# Altium schematic sheet SkayboardRev4.SchDoc
size A0
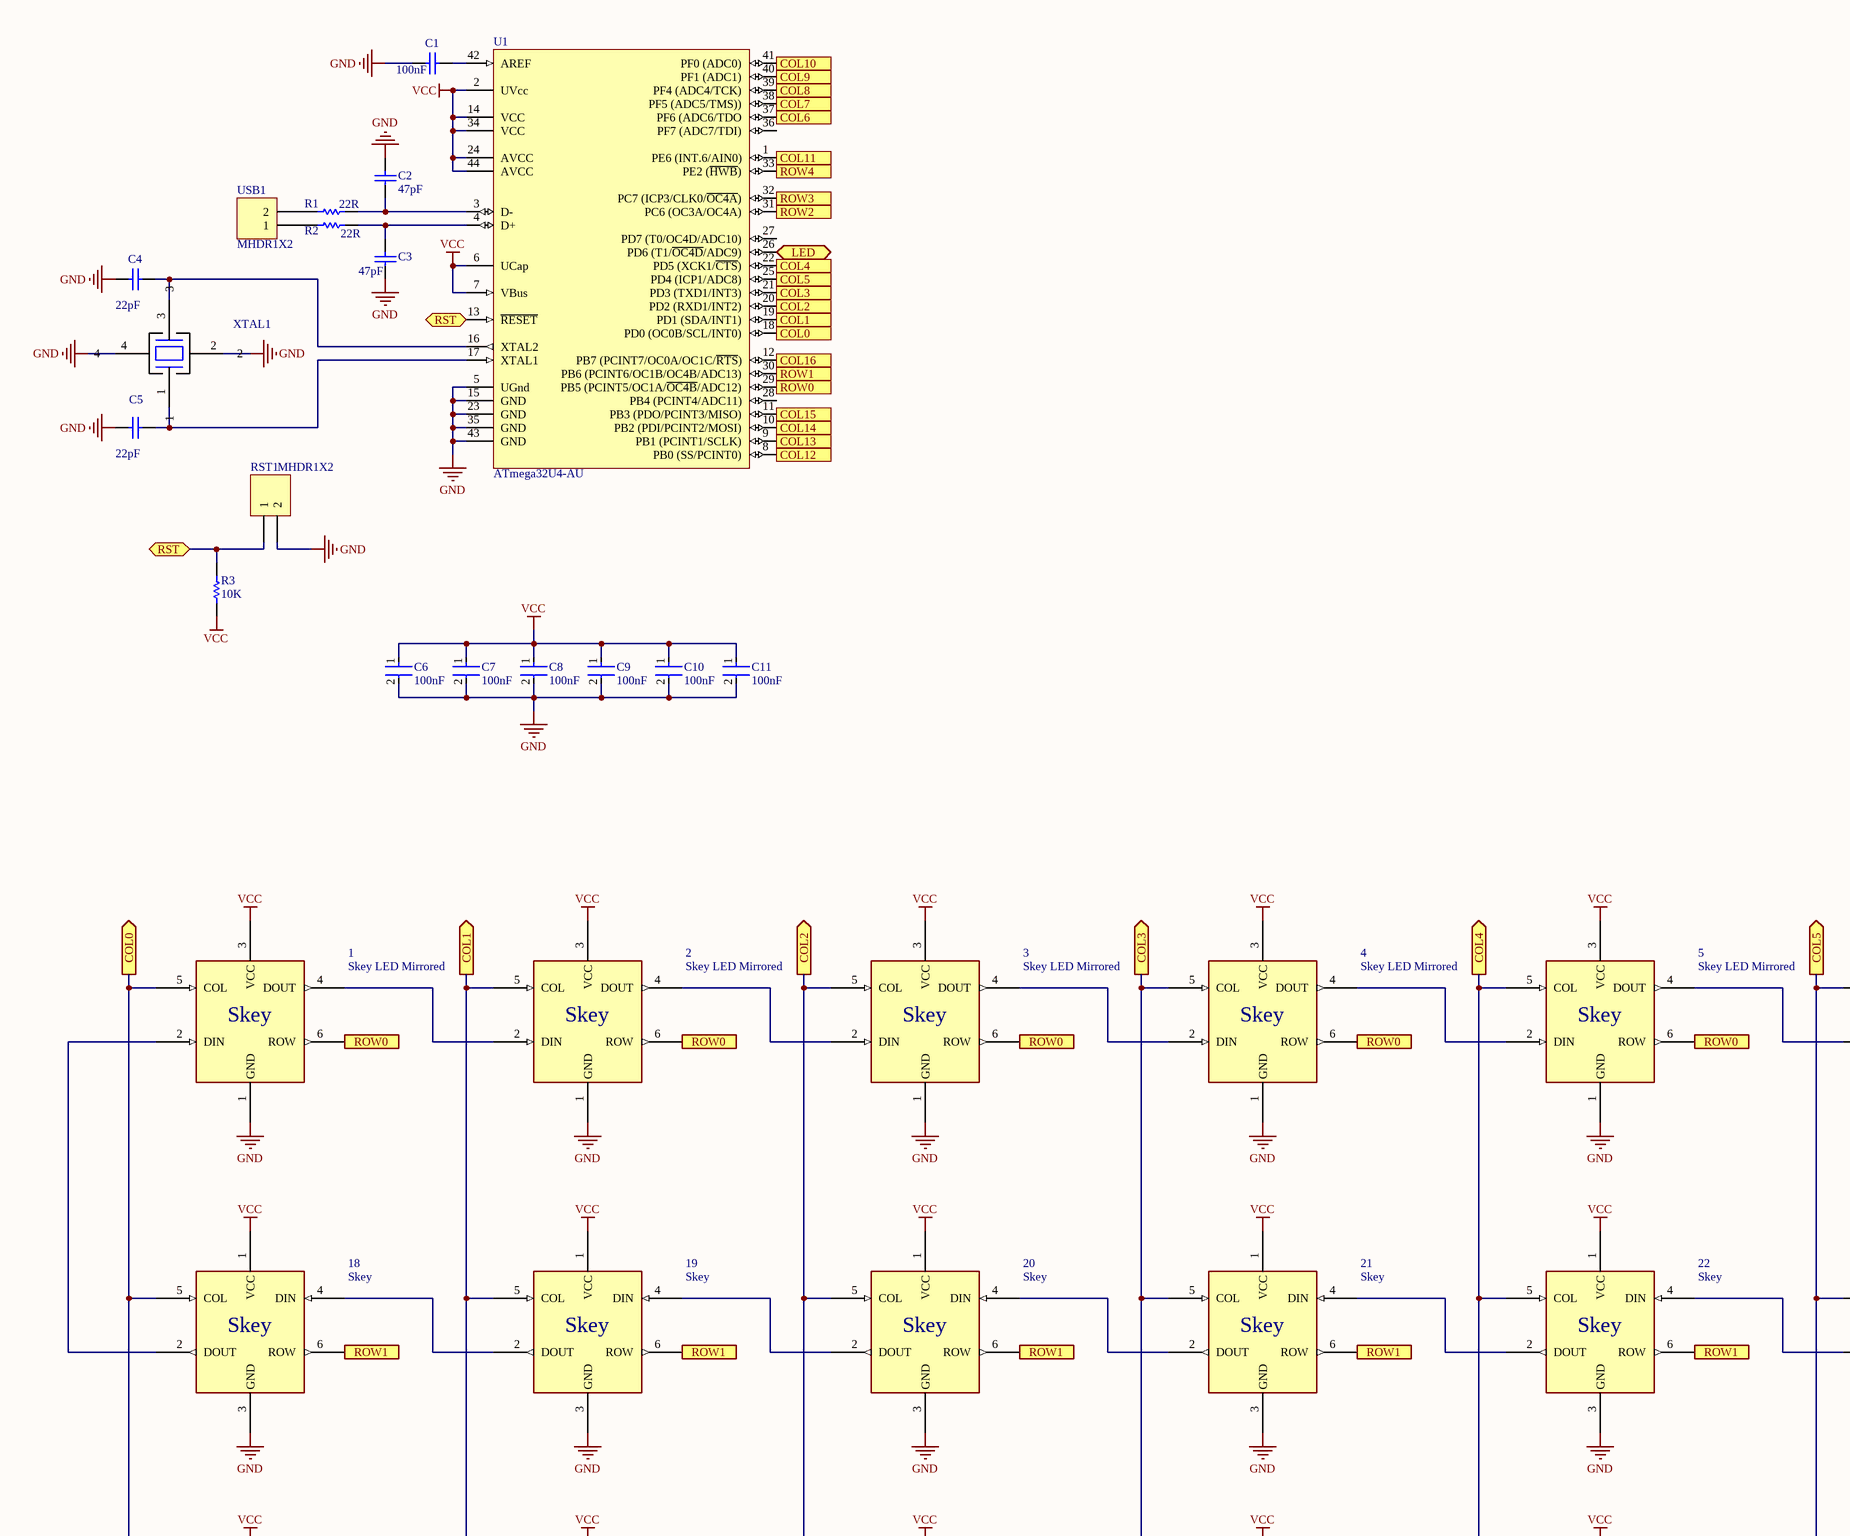
[diagram p0: SkayboardRev4.SchDoc, top left]
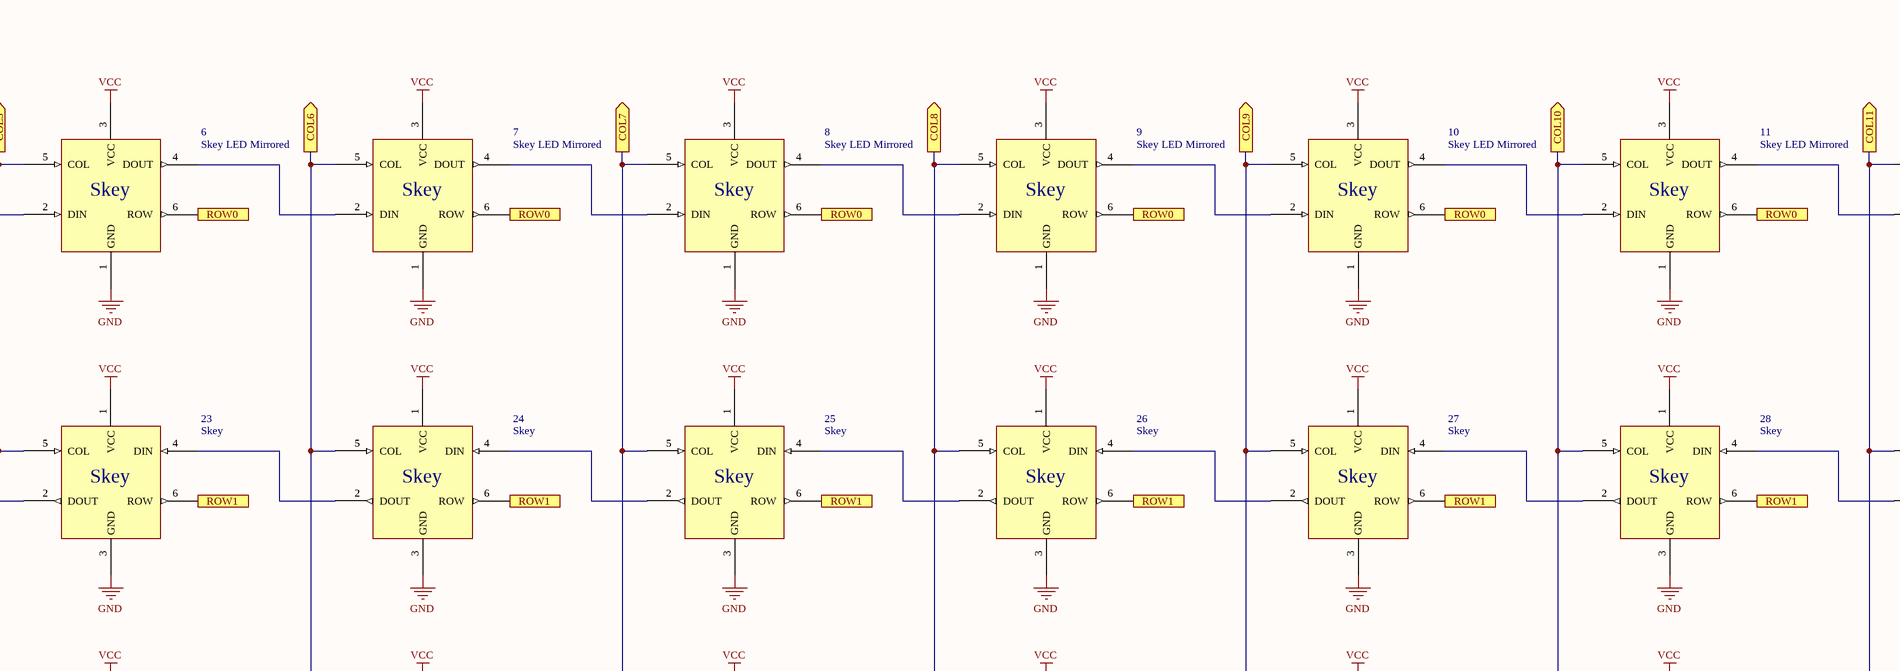
[diagram p1: SkayboardRev4.SchDoc, top middle]
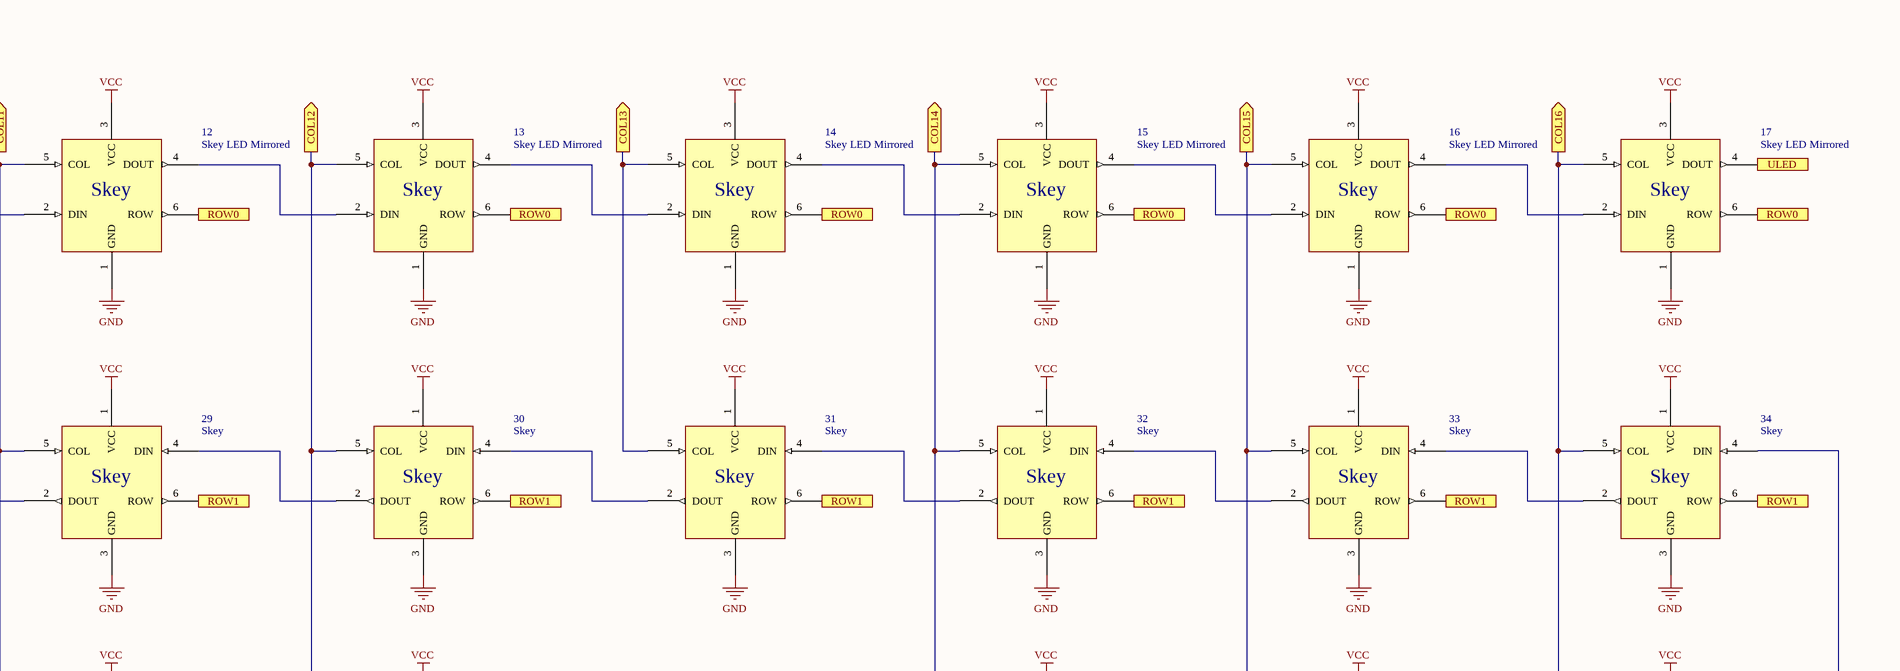
[diagram p2: SkayboardRev4.SchDoc, top right]
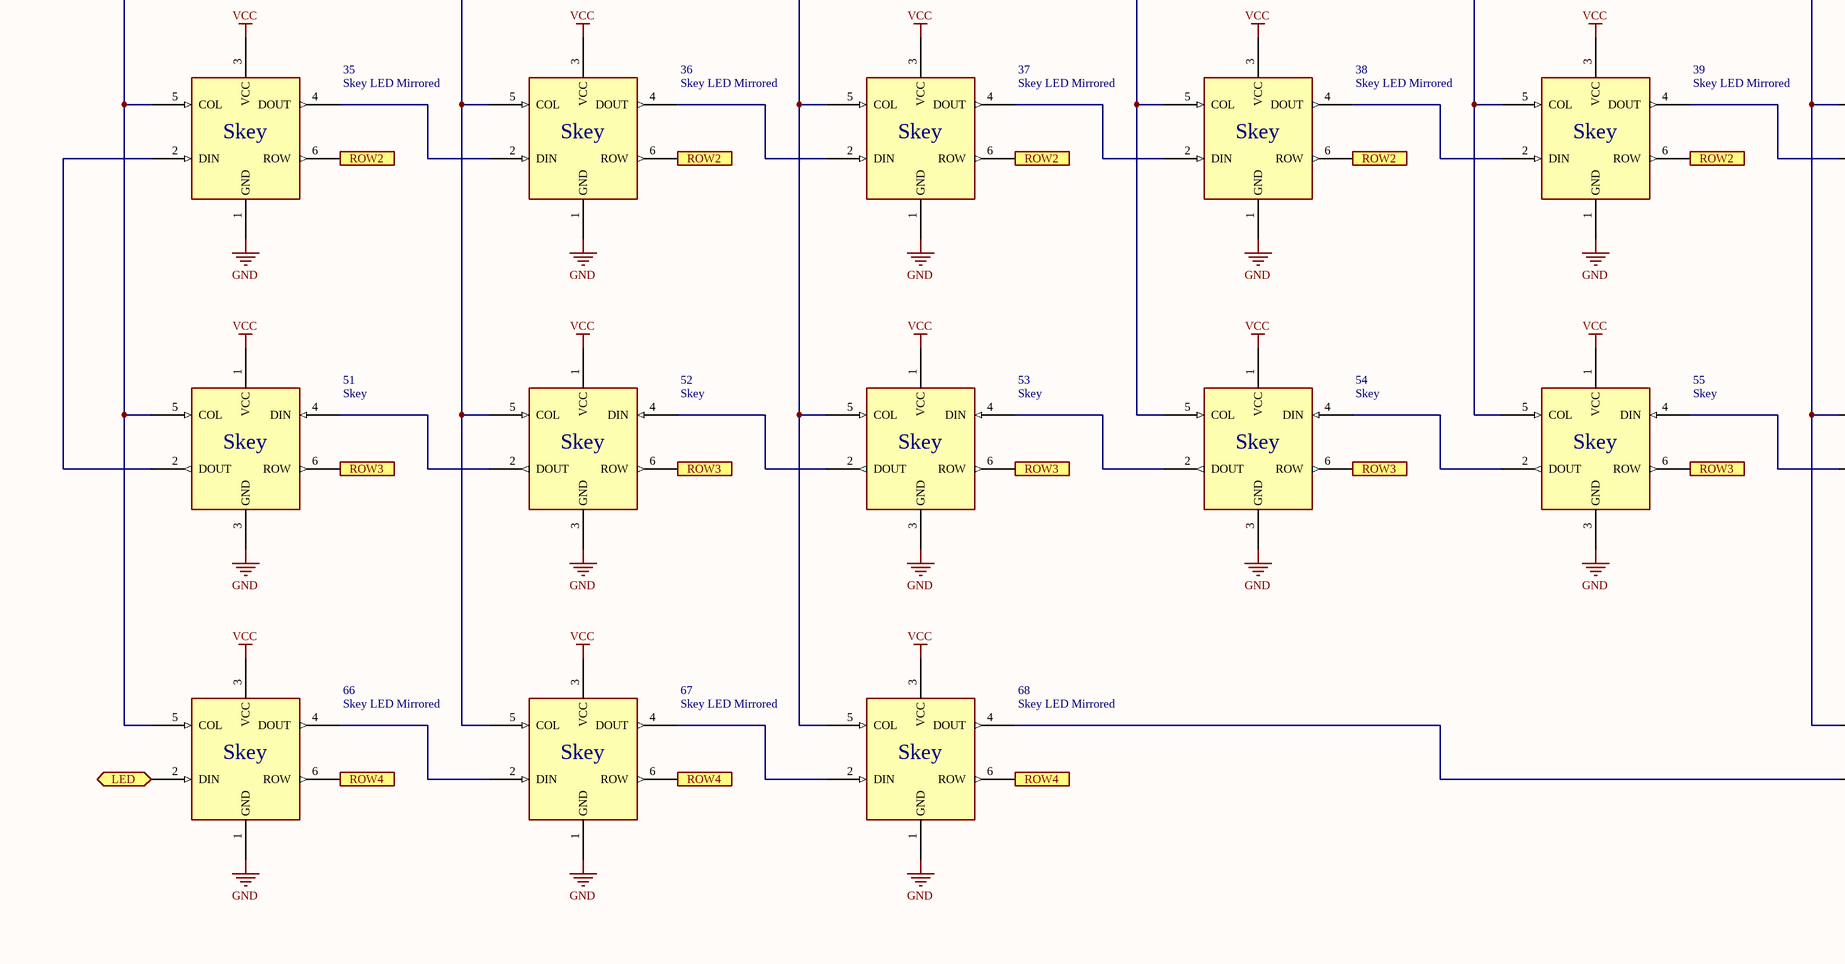
[diagram p3: SkayboardRev4.SchDoc, bottom left]
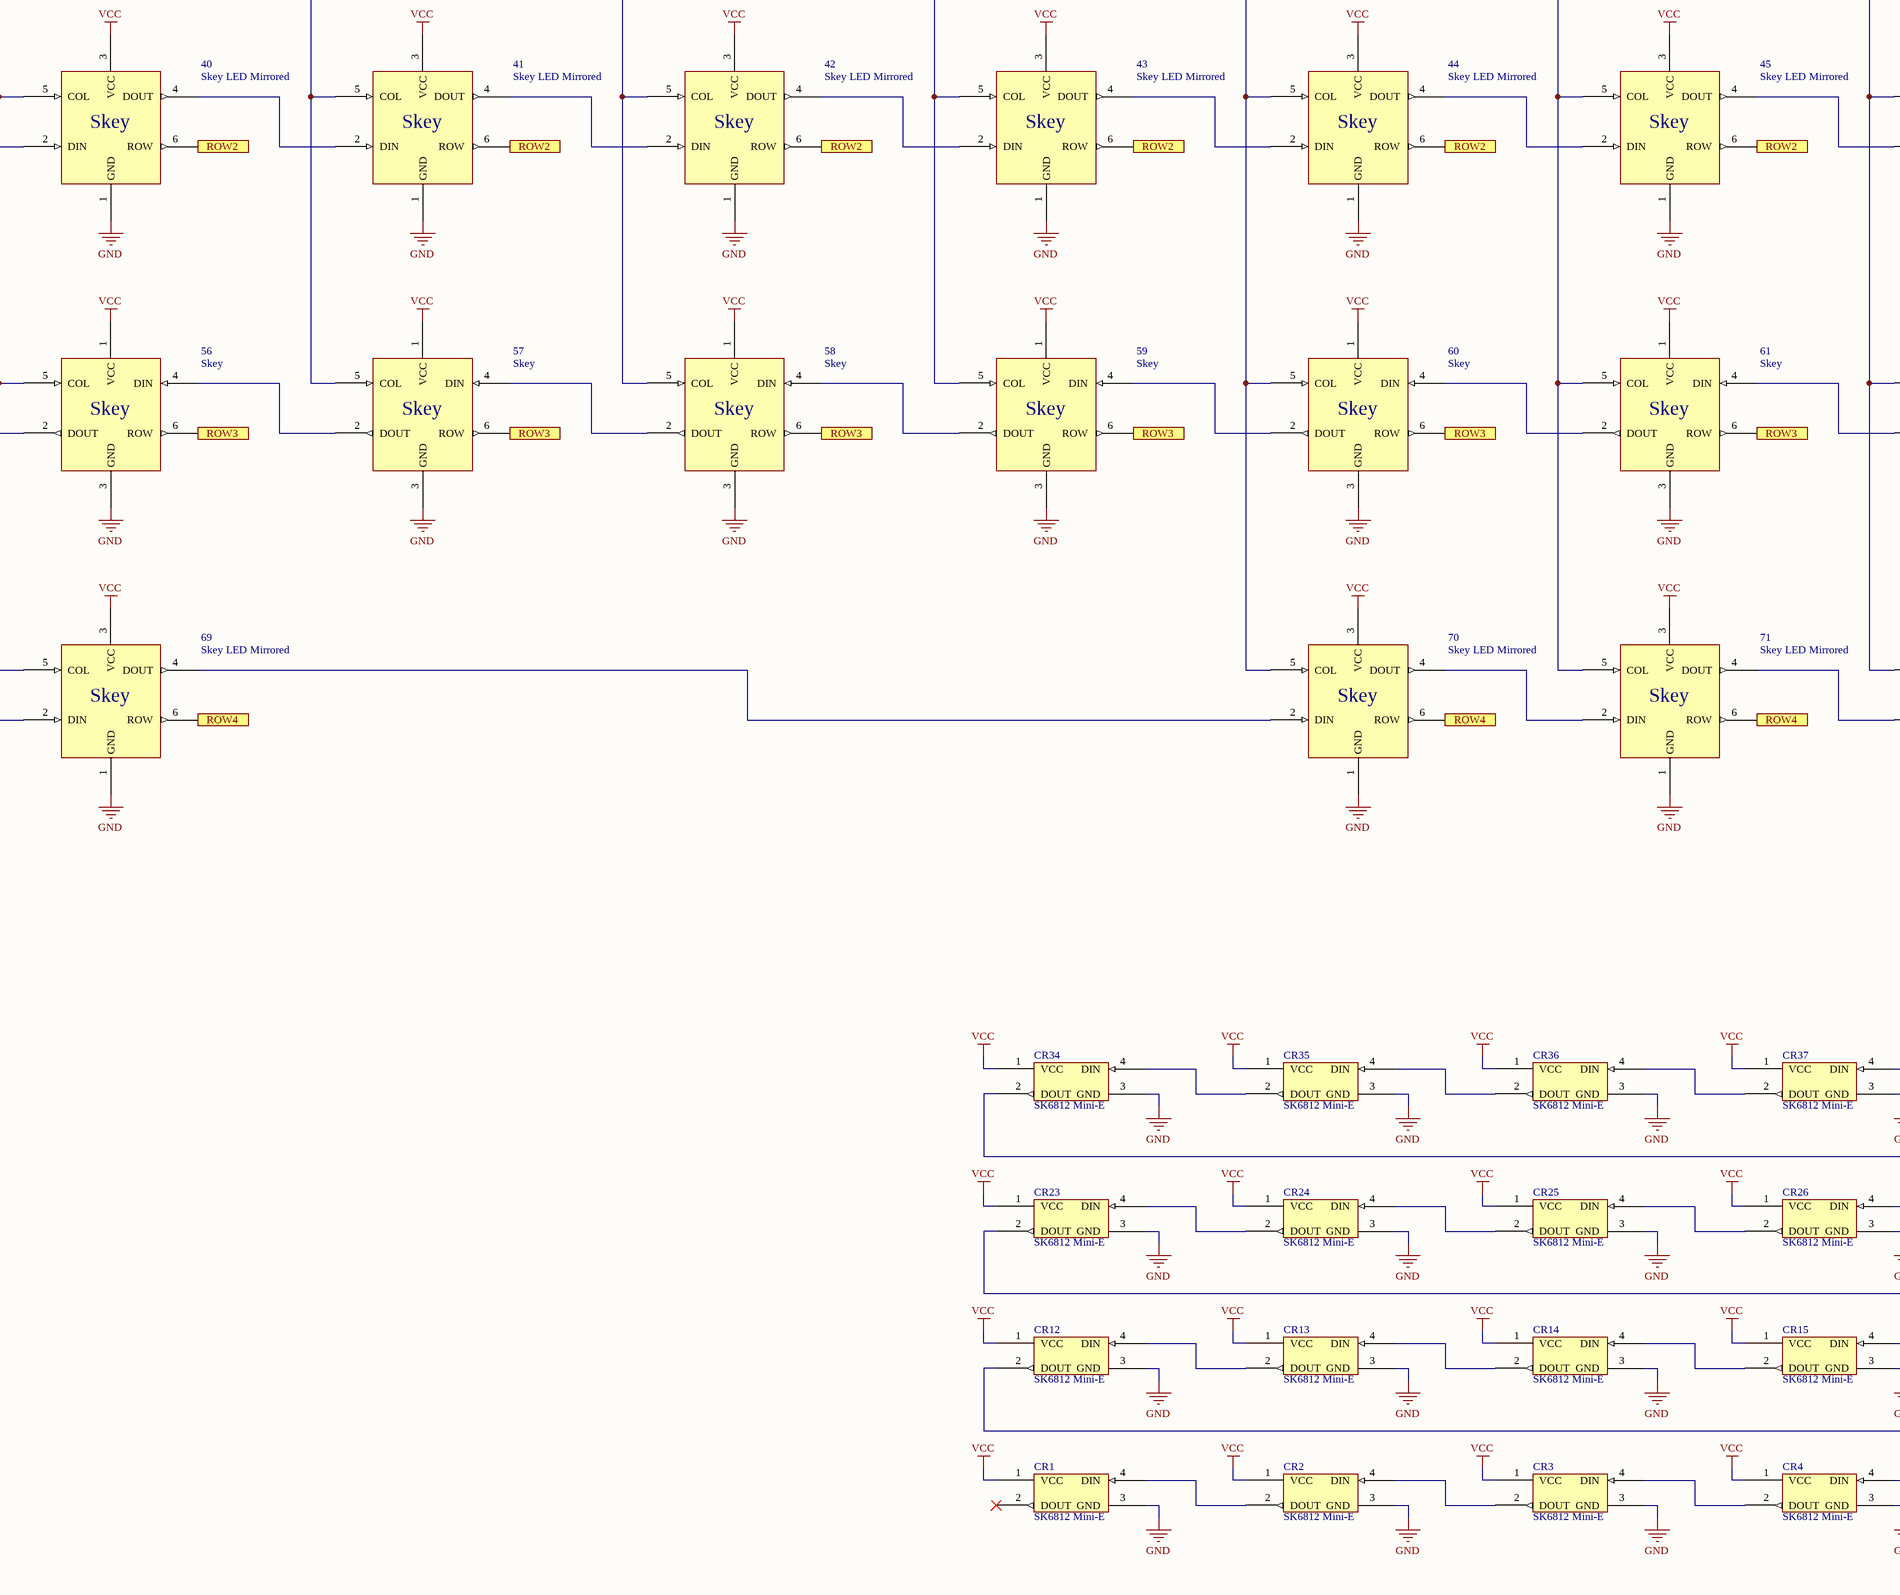
[diagram p4: SkayboardRev4.SchDoc, bottom middle]
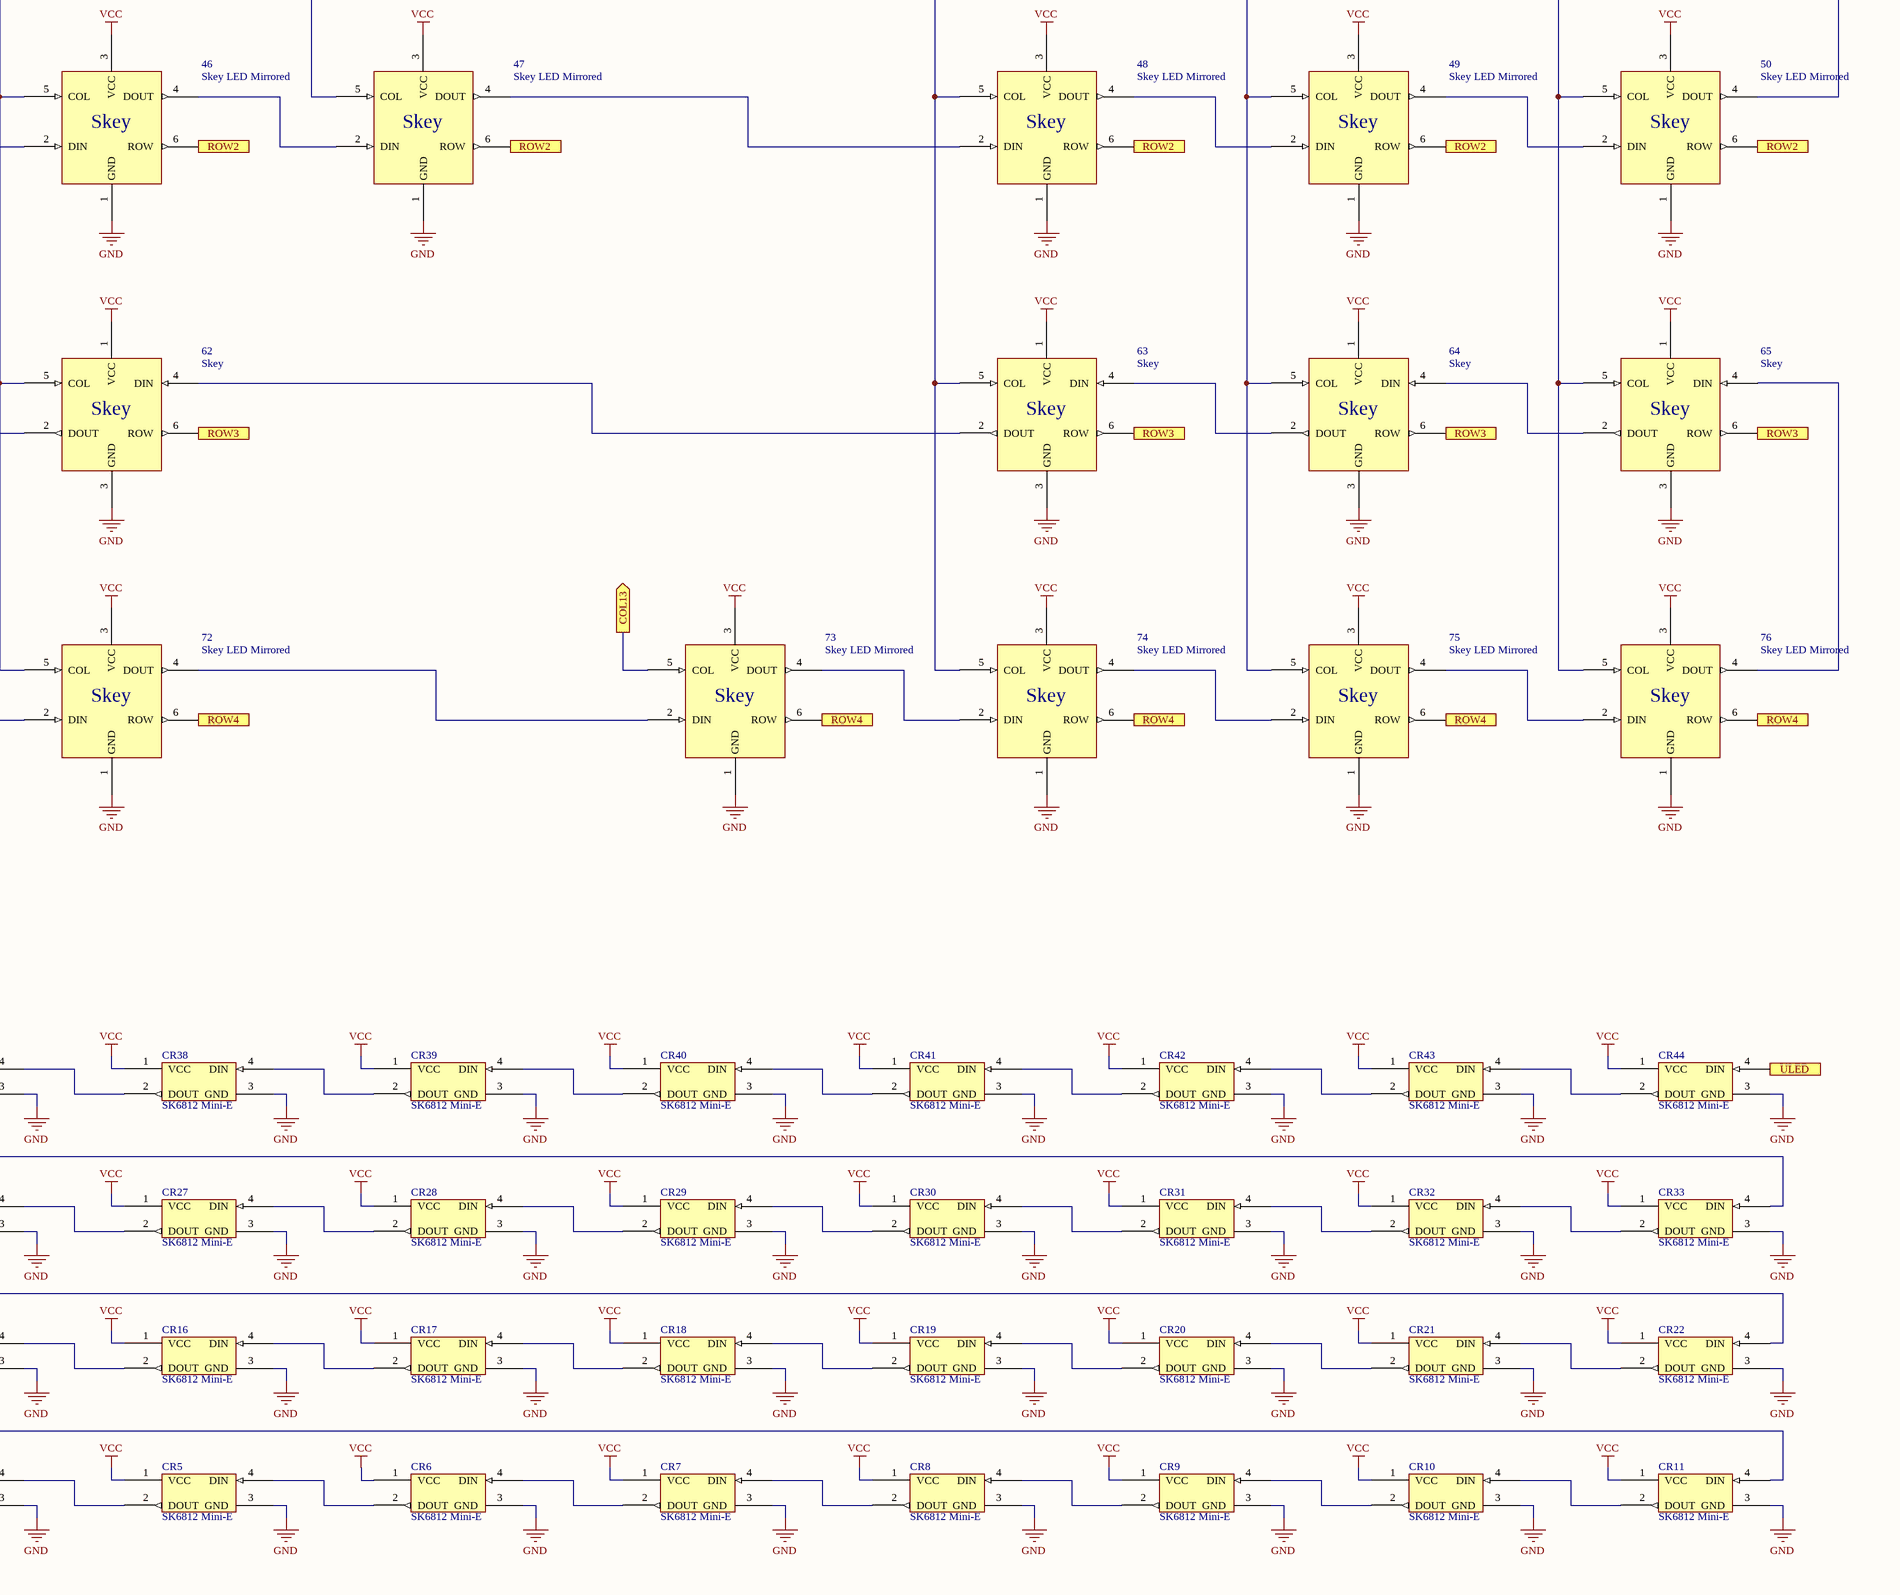
[diagram p5: SkayboardRev4.SchDoc, bottom right]

## Parts
1  Skey LED Mirrored  [MX RGB LM]
2  Skey LED Mirrored  [MX RGB LM]
3  Skey LED Mirrored  [MX RGB LM]
4  Skey LED Mirrored  [MX RGB LM]
5  Skey LED Mirrored  [MX RGB LM]
6  Skey LED Mirrored  [MX RGB LM]
7  Skey LED Mirrored  [MX RGB LM]
8  Skey LED Mirrored  [MX RGB LM]
9  Skey LED Mirrored  [MX RGB LM]
10  Skey LED Mirrored  [MX RGB LM]
11  Skey LED Mirrored  [MX RGB LM]
12  Skey LED Mirrored  [MX RGB LM]
13  Skey LED Mirrored  [MX RGB LM]
14  Skey LED Mirrored  [MX RGB LM]
15  Skey LED Mirrored  [MX RGB LM]
16  Skey LED Mirrored  [MX RGB LM]
17  Skey LED Mirrored  [MX RGB LM]
18  Skey  [MX RGB]
19  Skey  [MX RGB]
20  Skey  [MX RGB]
21  Skey  [MX RGB]
22  Skey  [MX RGB]
23  Skey  [MX RGB]
24  Skey  [MX RGB]
25  Skey  [MX RGB]
26  Skey  [MX RGB]
27  Skey  [MX RGB]
28  Skey  [MX RGB]
29  Skey  [MX RGB]
30  Skey  [MX RGB]
31  Skey  [MX RGB]
32  Skey  [MX RGB]
33  Skey  [MX RGB]
34  Skey  [MX RGB]
35  Skey LED Mirrored  [MX RGB LM]
36  Skey LED Mirrored  [MX RGB LM]
37  Skey LED Mirrored  [MX RGB LM]
38  Skey LED Mirrored  [MX RGB LM]
39  Skey LED Mirrored  [MX RGB LM]
40  Skey LED Mirrored  [MX RGB LM]
41  Skey LED Mirrored  [MX RGB LM]
42  Skey LED Mirrored  [MX RGB LM]
43  Skey LED Mirrored  [MX RGB LM]
44  Skey LED Mirrored  [MX RGB LM]
45  Skey LED Mirrored  [MX RGB LM]
46  Skey LED Mirrored  [MX RGB LM]
47  Skey LED Mirrored  [MX RGB LM]
48  Skey LED Mirrored  [MX RGB LM]
49  Skey LED Mirrored  [MX RGB LM]
50  Skey LED Mirrored  [MX RGB LM]
51  Skey  [MX RGB]
52  Skey  [MX RGB]
53  Skey  [MX RGB]
54  Skey  [MX RGB]
55  Skey  [MX RGB]
56  Skey  [MX RGB]
57  Skey  [MX RGB]
58  Skey  [MX RGB]
59  Skey  [MX RGB]
60  Skey  [MX RGB]
61  Skey  [MX RGB]
62  Skey  [MX RGB]
63  Skey  [MX RGB]
64  Skey  [MX RGB]
65  Skey  [MX RGB]
66  Skey LED Mirrored  [MX RGB LM]
67  Skey LED Mirrored  [MX RGB LM]
68  Skey LED Mirrored  [MX RGB LM]
69  Skey LED Mirrored  [MX RGB LM]
70  Skey LED Mirrored  [MX RGB LM]
71  Skey LED Mirrored  [MX RGB LM]
72  Skey LED Mirrored  [MX RGB LM]
73  Skey LED Mirrored  [MX RGB LM]
74  Skey LED Mirrored  [MX RGB LM]
75  Skey LED Mirrored  [MX RGB LM]
76  Skey LED Mirrored  [MX RGB LM]
C1  100nF  [CAPC1050X55X23ML05T13]
C2  47pF  [CAPC1005X55X30ML05T10]
C3  47pF  [CAPC1005X55X30ML05T10]
C4  22pF  [CAPC1005X56X25NL10T15]
C5  22pF  [CAPC1005X56X25NL10T15]
C6  100nF  [FP-C0402-BB-MFG]
C7  100nF  [FP-C0402-BB-MFG]
C8  100nF  [FP-C0402-BB-MFG]
C9  100nF  [FP-C0402-BB-MFG]
C10  100nF  [FP-C0402-BB-MFG]
C11  100nF  [FP-C0402-BB-MFG]
CR1  SK6812 Mini-E  [SK6812 Mini-E]
CR2  SK6812 Mini-E  [SK6812 Mini-E]
CR3  SK6812 Mini-E  [SK6812 Mini-E]
CR4  SK6812 Mini-E  [SK6812 Mini-E]
CR5  SK6812 Mini-E  [SK6812 Mini-E]
CR6  SK6812 Mini-E  [SK6812 Mini-E]
CR7  SK6812 Mini-E  [SK6812 Mini-E]
CR8  SK6812 Mini-E  [SK6812 Mini-E]
CR9  SK6812 Mini-E  [SK6812 Mini-E]
CR10  SK6812 Mini-E  [SK6812 Mini-E]
CR11  SK6812 Mini-E  [SK6812 Mini-E]
CR12  SK6812 Mini-E  [SK6812 Mini-E]
CR13  SK6812 Mini-E  [SK6812 Mini-E]
CR14  SK6812 Mini-E  [SK6812 Mini-E]
CR15  SK6812 Mini-E  [SK6812 Mini-E]
CR16  SK6812 Mini-E  [SK6812 Mini-E]
CR17  SK6812 Mini-E  [SK6812 Mini-E]
CR18  SK6812 Mini-E  [SK6812 Mini-E]
CR19  SK6812 Mini-E  [SK6812 Mini-E]
CR20  SK6812 Mini-E  [SK6812 Mini-E]
CR21  SK6812 Mini-E  [SK6812 Mini-E]
CR22  SK6812 Mini-E  [SK6812 Mini-E]
CR23  SK6812 Mini-E  [SK6812 Mini-E]
CR24  SK6812 Mini-E  [SK6812 Mini-E]
CR25  SK6812 Mini-E  [SK6812 Mini-E]
CR26  SK6812 Mini-E  [SK6812 Mini-E]
CR27  SK6812 Mini-E  [SK6812 Mini-E]
CR28  SK6812 Mini-E  [SK6812 Mini-E]
CR29  SK6812 Mini-E  [SK6812 Mini-E]
CR30  SK6812 Mini-E  [SK6812 Mini-E]
CR31  SK6812 Mini-E  [SK6812 Mini-E]
CR32  SK6812 Mini-E  [SK6812 Mini-E]
CR33  SK6812 Mini-E  [SK6812 Mini-E]
CR34  SK6812 Mini-E  [SK6812 Mini-E]
CR35  SK6812 Mini-E  [SK6812 Mini-E]
CR36  SK6812 Mini-E  [SK6812 Mini-E]
CR37  SK6812 Mini-E  [SK6812 Mini-E]
CR38  SK6812 Mini-E  [SK6812 Mini-E]
CR39  SK6812 Mini-E  [SK6812 Mini-E]
CR40  SK6812 Mini-E  [SK6812 Mini-E]
CR41  SK6812 Mini-E  [SK6812 Mini-E]
CR42  SK6812 Mini-E  [SK6812 Mini-E]
CR43  SK6812 Mini-E  [SK6812 Mini-E]
CR44  SK6812 Mini-E  [SK6812 Mini-E]
R1  22R  [RESC1005X40X25LL05T05]
R2  22R  [RESC1005X40X25LL05T05]
R3  10K  [RESC1005X40X25NL05T05]
RST1  MHDR1X2  [MHDR1X2]
U1  ATmega32U4-AU  [44ML_M]
USB1  MHDR1X2  [MHDR1X2]
XTAL1  (no value)  [16Mhz]

## Ports
COL0 (in), COL0 (out), COL1 (in), COL1 (out), COL2 (in), COL2 (out), COL3 (in), COL3 (out), COL4 (in), COL4 (out), COL5 (in), COL5 (out), COL6 (in), COL6 (out), COL7 (in), COL7 (out), COL8 (in), COL8 (out), COL9 (in), COL9 (out), COL10 (in), COL10 (out), COL11 (in), COL11 (out), COL12 (in), COL12 (out), COL13 (in), COL13 (out), COL14 (in), COL14 (out), COL15 (in), COL15 (out), COL16 (in), COL16 (out), LED (bidir), ROW0 (out), ROW1 (out), ROW2 (out), ROW3 (out), ROW4 (out), RST (bidir), ULED (out)

## Nets
GND: 1.1(GND) 2.1(GND) 3.1(GND) 4.1(GND) 5.1(GND) 6.1(GND) 7.1(GND) 8.1(GND) 9.1(GND) 10.1(GND) 11.1(GND) 12.1(GND) 13.1(GND) 14.1(GND) 15.1(GND) 16.1(GND) 17.1(GND) 18.3(GND) 19.3(GND) 20.3(GND) 21.3(GND) 22.3(GND) 23.3(GND) 24.3(GND) 25.3(GND) 26.3(GND) 27.3(GND) 28.3(GND) 29.3(GND) 30.3(GND) 31.3(GND) 32.3(GND) 33.3(GND) 34.3(GND) 35.1(GND) 36.1(GND) 37.1(GND) 38.1(GND) 39.1(GND) 40.1(GND) 41.1(GND) 42.1(GND) 43.1(GND) 44.1(GND) 45.1(GND) 46.1(GND) 47.1(GND) 48.1(GND) 49.1(GND) 50.1(GND) 51.3(GND) 52.3(GND) 53.3(GND) 54.3(GND) 55.3(GND) 56.3(GND) 57.3(GND) 58.3(GND) 59.3(GND) 60.3(GND) 61.3(GND) 62.3(GND) 63.3(GND) 64.3(GND) 65.3(GND) 66.1(GND) 67.1(GND) 68.1(GND) 69.1(GND) 70.1(GND) 71.1(GND) 72.1(GND) 73.1(GND) 74.1(GND) 75.1(GND) 76.1(GND) C1.1 C2.2 C3.1 C4.1 C5.1 C6.2 C7.2 C8.2 C9.2 C10.2 C11.2 CR1.3(GND) CR2.3(GND) CR3.3(GND) CR4.3(GND) CR5.3(GND) CR6.3(GND) CR7.3(GND) CR8.3(GND) CR9.3(GND) CR10.3(GND) CR11.3(GND) CR12.3(GND) CR13.3(GND) CR14.3(GND) CR15.3(GND) CR16.3(GND) CR17.3(GND) CR18.3(GND) CR19.3(GND) CR20.3(GND) CR21.3(GND) CR22.3(GND) CR23.3(GND) CR24.3(GND) CR25.3(GND) CR26.3(GND) CR27.3(GND) CR28.3(GND) CR29.3(GND) CR30.3(GND) CR31.3(GND) CR32.3(GND) CR33.3(GND) CR34.3(GND) CR35.3(GND) CR36.3(GND) CR37.3(GND) CR38.3(GND) CR39.3(GND) CR40.3(GND) CR41.3(GND) CR42.3(GND) CR43.3(GND) CR44.3(GND) RST1.2 U1.5(UGnd) U1.15(GND) U1.23(GND) U1.35(GND) U1.43(GND)
VCC: 1.3(VCC) 2.3(VCC) 3.3(VCC) 4.3(VCC) 5.3(VCC) 6.3(VCC) 7.3(VCC) 8.3(VCC) 9.3(VCC) 10.3(VCC) 11.3(VCC) 12.3(VCC) 13.3(VCC) 14.3(VCC) 15.3(VCC) 16.3(VCC) 17.3(VCC) 18.1(VCC) 19.1(VCC) 20.1(VCC) 21.1(VCC) 22.1(VCC) 23.1(VCC) 24.1(VCC) 25.1(VCC) 26.1(VCC) 27.1(VCC) 28.1(VCC) 29.1(VCC) 30.1(VCC) 31.1(VCC) 32.1(VCC) 33.1(VCC) 34.1(VCC) 35.3(VCC) 36.3(VCC) 37.3(VCC) 38.3(VCC) 39.3(VCC) 40.3(VCC) 41.3(VCC) 42.3(VCC) 43.3(VCC) 44.3(VCC) 45.3(VCC) 46.3(VCC) 47.3(VCC) 48.3(VCC) 49.3(VCC) 50.3(VCC) 51.1(VCC) 52.1(VCC) 53.1(VCC) 54.1(VCC) 55.1(VCC) 56.1(VCC) 57.1(VCC) 58.1(VCC) 59.1(VCC) 60.1(VCC) 61.1(VCC) 62.1(VCC) 63.1(VCC) 64.1(VCC) 65.1(VCC) 66.3(VCC) 67.3(VCC) 68.3(VCC) 69.3(VCC) 70.3(VCC) 71.3(VCC) 72.3(VCC) 73.3(VCC) 74.3(VCC) 75.3(VCC) 76.3(VCC) C6.1 C7.1 C8.1 C9.1 C10.1 C11.1 CR1.1(VCC) CR2.1(VCC) CR3.1(VCC) CR4.1(VCC) CR5.1(VCC) CR6.1(VCC) CR7.1(VCC) CR8.1(VCC) CR9.1(VCC) CR10.1(VCC) CR11.1(VCC) CR12.1(VCC) CR13.1(VCC) CR14.1(VCC) CR15.1(VCC) CR16.1(VCC) CR17.1(VCC) CR18.1(VCC) CR19.1(VCC) CR20.1(VCC) CR21.1(VCC) CR22.1(VCC) CR23.1(VCC) CR24.1(VCC) CR25.1(VCC) CR26.1(VCC) CR27.1(VCC) CR28.1(VCC) CR29.1(VCC) CR30.1(VCC) CR31.1(VCC) CR32.1(VCC) CR33.1(VCC) CR34.1(VCC) CR35.1(VCC) CR36.1(VCC) CR37.1(VCC) CR38.1(VCC) CR39.1(VCC) CR40.1(VCC) CR41.1(VCC) CR42.1(VCC) CR43.1(VCC) CR44.1(VCC) R3.1 U1.2(UVcc) U1.6(UCap) U1.7(VBus) U1.14(VCC) U1.24(AVCC) U1.34(VCC) U1.44(AVCC)
COL0: 1.5(COL) 18.5(COL) 35.5(COL) 51.5(COL) 66.5(COL) U1.18(PD0_(OC0B/SCL/INT0)) ; port COL0
COL1: 2.5(COL) 19.5(COL) 36.5(COL) 52.5(COL) 67.5(COL) U1.19(PD1_(SDA/INT1)) ; port COL1
COL2: 3.5(COL) 20.5(COL) 37.5(COL) 53.5(COL) 68.5(COL) U1.20(PD2_(RXD1/INT2)) ; port COL2
COL3: 4.5(COL) 21.5(COL) 38.5(COL) 54.5(COL) U1.21(PD3_(TXD1/INT3)) ; port COL3
COL4: 5.5(COL) 22.5(COL) 39.5(COL) 55.5(COL) U1.22(PD5_(XCK1/~{CTS})) ; port COL4
COL5: 6.5(COL) 23.5(COL) 40.5(COL) 56.5(COL) 69.5(COL) U1.25(PD4_(ICP1/ADC8)) ; port COL5
COL6: 7.5(COL) 24.5(COL) 41.5(COL) 57.5(COL) U1.37(PF6_(ADC6/TDO) ; port COL6
COL7: 8.5(COL) 25.5(COL) 42.5(COL) 58.5(COL) U1.38(PF5_(ADC5/TMS))) ; port COL7
COL8: 9.5(COL) 26.5(COL) 43.5(COL) 59.5(COL) U1.39(PF4_(ADC4/TCK)) ; port COL8
COL9: 10.5(COL) 27.5(COL) 44.5(COL) 60.5(COL) 70.5(COL) U1.40(PF1_(ADC1)) ; port COL9
COL10: 11.5(COL) 28.5(COL) 45.5(COL) 61.5(COL) 71.5(COL) U1.41(PF0_(ADC0)) ; port COL10
COL11: 12.5(COL) 29.5(COL) 46.5(COL) 62.5(COL) 72.5(COL) U1.1(PE6_(INT.6/AIN0)) ; port COL11
COL12: 13.5(COL) 30.5(COL) 47.5(COL) U1.8(PB0_(SS/PCINT0)) ; port COL12
COL13: 14.5(COL) 31.5(COL) 73.5(COL) U1.9(PB1_(PCINT1/SCLK)) ; port COL13
COL14: 15.5(COL) 32.5(COL) 48.5(COL) 63.5(COL) 74.5(COL) U1.10(PB2_(PDI/PCINT2/MOSI)) ; port COL14
COL15: 16.5(COL) 33.5(COL) 49.5(COL) 64.5(COL) 75.5(COL) U1.11(PB3_(PDO/PCINT3/MISO)) ; port COL15
COL16: 17.5(COL) 34.5(COL) 50.5(COL) 65.5(COL) 76.5(COL) U1.12(PB7_(PCINT7/OC0A/OC1C/~{RTS})) ; port COL16
LED: 66.2(DIN) U1.26(PD6_(T1/~{OC4D}/ADC9)) ; port LED
ROW0: 1.6(ROW) 2.6(ROW) 3.6(ROW) 4.6(ROW) 5.6(ROW) 6.6(ROW) 7.6(ROW) 8.6(ROW) 9.6(ROW) 10.6(ROW) 11.6(ROW) 12.6(ROW) 13.6(ROW) 14.6(ROW) 15.6(ROW) 16.6(ROW) 17.6(ROW) U1.29(PB5_(PCINT5/OC1A/~{OC4B}/ADC12)) ; port ROW0
ROW1: 18.6(ROW) 19.6(ROW) 20.6(ROW) 21.6(ROW) 22.6(ROW) 23.6(ROW) 24.6(ROW) 25.6(ROW) 26.6(ROW) 27.6(ROW) 28.6(ROW) 29.6(ROW) 30.6(ROW) 31.6(ROW) 32.6(ROW) 33.6(ROW) 34.6(ROW) U1.30(PB6_(PCINT6/OC1B/OC4B/ADC13)) ; port ROW1
ROW2: 35.6(ROW) 36.6(ROW) 37.6(ROW) 38.6(ROW) 39.6(ROW) 40.6(ROW) 41.6(ROW) 42.6(ROW) 43.6(ROW) 44.6(ROW) 45.6(ROW) 46.6(ROW) 47.6(ROW) 48.6(ROW) 49.6(ROW) 50.6(ROW) U1.31(PC6_(OC3A/OC4A)) ; port ROW2
ROW3: 51.6(ROW) 52.6(ROW) 53.6(ROW) 54.6(ROW) 55.6(ROW) 56.6(ROW) 57.6(ROW) 58.6(ROW) 59.6(ROW) 60.6(ROW) 61.6(ROW) 62.6(ROW) 63.6(ROW) 64.6(ROW) 65.6(ROW) U1.32(PC7_(ICP3/CLK0/~{OC4A})) ; port ROW3
ROW4: 66.6(ROW) 67.6(ROW) 68.6(ROW) 69.6(ROW) 70.6(ROW) 71.6(ROW) 72.6(ROW) 73.6(ROW) 74.6(ROW) 75.6(ROW) 76.6(ROW) U1.33(PE2_(~{HWB})) ; port ROW4
RST: R3.2 RST1.1 U1.13(~{RESET}) ; port RST
ULED: 17.4(DOUT) CR44.4(DIN) ; port ULED
Net1_2: 1.2(DIN) 18.2(DOUT)
Net1_4: 1.4(DOUT) 2.2(DIN)
Net2_4: 2.4(DOUT) 3.2(DIN)
Net3_4: 3.4(DOUT) 4.2(DIN)
Net4_4: 4.4(DOUT) 5.2(DIN)
Net5_4: 5.4(DOUT) 6.2(DIN)
Net6_4: 6.4(DOUT) 7.2(DIN)
Net7_4: 7.4(DOUT) 8.2(DIN)
Net8_4: 8.4(DOUT) 9.2(DIN)
Net9_4: 9.4(DOUT) 10.2(DIN)
Net10_4: 10.4(DOUT) 11.2(DIN)
Net11_4: 11.4(DOUT) 12.2(DIN)
Net12_4: 12.4(DOUT) 13.2(DIN)
Net13_4: 13.4(DOUT) 14.2(DIN)
Net14_4: 14.4(DOUT) 15.2(DIN)
Net15_4: 15.4(DOUT) 16.2(DIN)
Net16_4: 16.4(DOUT) 17.2(DIN)
Net18_4: 18.4(DIN) 19.2(DOUT)
Net19_4: 19.4(DIN) 20.2(DOUT)
Net20_4: 20.4(DIN) 21.2(DOUT)
Net21_4: 21.4(DIN) 22.2(DOUT)
Net22_4: 22.4(DIN) 23.2(DOUT)
Net23_4: 23.4(DIN) 24.2(DOUT)
Net24_4: 24.4(DIN) 25.2(DOUT)
Net25_4: 25.4(DIN) 26.2(DOUT)
Net26_4: 26.4(DIN) 27.2(DOUT)
Net27_4: 27.4(DIN) 28.2(DOUT)
Net28_4: 28.4(DIN) 29.2(DOUT)
Net29_4: 29.4(DIN) 30.2(DOUT)
Net30_4: 30.4(DIN) 31.2(DOUT)
Net31_4: 31.4(DIN) 32.2(DOUT)
Net32_4: 32.4(DIN) 33.2(DOUT)
Net33_4: 33.4(DIN) 34.2(DOUT)
Net34_4: 34.4(DIN) 50.4(DOUT)
Net35_2: 35.2(DIN) 51.2(DOUT)
Net35_4: 35.4(DOUT) 36.2(DIN)
Net36_4: 36.4(DOUT) 37.2(DIN)
Net37_4: 37.4(DOUT) 38.2(DIN)
Net38_4: 38.4(DOUT) 39.2(DIN)
Net39_4: 39.4(DOUT) 40.2(DIN)
Net40_4: 40.4(DOUT) 41.2(DIN)
Net41_4: 41.4(DOUT) 42.2(DIN)
Net42_4: 42.4(DOUT) 43.2(DIN)
Net43_4: 43.4(DOUT) 44.2(DIN)
Net44_4: 44.4(DOUT) 45.2(DIN)
Net45_4: 45.4(DOUT) 46.2(DIN)
Net46_4: 46.4(DOUT) 47.2(DIN)
Net47_4: 47.4(DOUT) 48.2(DIN)
Net48_4: 48.4(DOUT) 49.2(DIN)
Net49_4: 49.4(DOUT) 50.2(DIN)
Net51_4: 51.4(DIN) 52.2(DOUT)
Net52_4: 52.4(DIN) 53.2(DOUT)
Net53_4: 53.4(DIN) 54.2(DOUT)
Net54_4: 54.4(DIN) 55.2(DOUT)
Net55_4: 55.4(DIN) 56.2(DOUT)
Net56_4: 56.4(DIN) 57.2(DOUT)
Net57_4: 57.4(DIN) 58.2(DOUT)
Net58_4: 58.4(DIN) 59.2(DOUT)
Net59_4: 59.4(DIN) 60.2(DOUT)
Net60_4: 60.4(DIN) 61.2(DOUT)
Net61_4: 61.4(DIN) 62.2(DOUT)
Net62_4: 62.4(DIN) 63.2(DOUT)
Net63_4: 63.4(DIN) 64.2(DOUT)
Net64_4: 64.4(DIN) 65.2(DOUT)
Net65_4: 65.4(DIN) 76.4(DOUT)
Net66_4: 66.4(DOUT) 67.2(DIN)
Net67_4: 67.4(DOUT) 68.2(DIN)
Net68_4: 68.4(DOUT) 69.2(DIN)
Net69_4: 69.4(DOUT) 70.2(DIN)
Net70_4: 70.4(DOUT) 71.2(DIN)
Net71_4: 71.4(DOUT) 72.2(DIN)
Net72_4: 72.4(DOUT) 73.2(DIN)
Net73_4: 73.4(DOUT) 74.2(DIN)
Net74_4: 74.4(DOUT) 75.2(DIN)
Net75_4: 75.4(DOUT) 76.2(DIN)
NetC1_2: C1.2 U1.42(AREF)
NetC2_1: C2.1 R1.1 U1.3(D-)
NetC3_2: C3.2 R2.1 U1.4(D+)
NetC4_2: C4.2 U1.16(XTAL2)
NetC5_2: C5.2 U1.17(XTAL1)
NetCR1_4: CR1.4(DIN) CR2.2(DOUT)
NetCR2_4: CR2.4(DIN) CR3.2(DOUT)
NetCR3_4: CR3.4(DIN) CR4.2(DOUT)
NetCR4_4: CR4.4(DIN) CR5.2(DOUT)
NetCR5_4: CR5.4(DIN) CR6.2(DOUT)
NetCR6_4: CR6.4(DIN) CR7.2(DOUT)
NetCR7_4: CR7.4(DIN) CR8.2(DOUT)
NetCR8_4: CR8.4(DIN) CR9.2(DOUT)
NetCR9_4: CR9.4(DIN) CR10.2(DOUT)
NetCR10_4: CR10.4(DIN) CR11.2(DOUT)
NetCR11_4: CR11.4(DIN) CR12.2(DOUT)
NetCR12_4: CR12.4(DIN) CR13.2(DOUT)
NetCR13_4: CR13.4(DIN) CR14.2(DOUT)
NetCR14_4: CR14.4(DIN) CR15.2(DOUT)
NetCR15_4: CR15.4(DIN) CR16.2(DOUT)
NetCR16_4: CR16.4(DIN) CR17.2(DOUT)
NetCR17_4: CR17.4(DIN) CR18.2(DOUT)
NetCR18_4: CR18.4(DIN) CR19.2(DOUT)
NetCR19_4: CR19.4(DIN) CR20.2(DOUT)
NetCR20_4: CR20.4(DIN) CR21.2(DOUT)
NetCR21_4: CR21.4(DIN) CR22.2(DOUT)
NetCR22_4: CR22.4(DIN) CR23.2(DOUT)
NetCR23_4: CR23.4(DIN) CR24.2(DOUT)
NetCR24_4: CR24.4(DIN) CR25.2(DOUT)
NetCR25_4: CR25.4(DIN) CR26.2(DOUT)
NetCR26_4: CR26.4(DIN) CR27.2(DOUT)
NetCR27_4: CR27.4(DIN) CR28.2(DOUT)
NetCR28_4: CR28.4(DIN) CR29.2(DOUT)
NetCR29_4: CR29.4(DIN) CR30.2(DOUT)
NetCR30_4: CR30.4(DIN) CR31.2(DOUT)
NetCR31_4: CR31.4(DIN) CR32.2(DOUT)
NetCR32_4: CR32.4(DIN) CR33.2(DOUT)
NetCR33_4: CR33.4(DIN) CR34.2(DOUT)
NetCR34_4: CR34.4(DIN) CR35.2(DOUT)
NetCR35_4: CR35.4(DIN) CR36.2(DOUT)
NetCR36_4: CR36.4(DIN) CR37.2(DOUT)
NetCR37_4: CR37.4(DIN) CR38.2(DOUT)
NetCR38_4: CR38.4(DIN) CR39.2(DOUT)
NetCR39_4: CR39.4(DIN) CR40.2(DOUT)
NetCR40_4: CR40.4(DIN) CR41.2(DOUT)
NetCR41_4: CR41.4(DIN) CR42.2(DOUT)
NetCR42_4: CR42.4(DIN) CR43.2(DOUT)
NetCR43_4: CR43.4(DIN) CR44.2(DOUT)
NetR1_2: R1.2 USB1.2
NetR2_2: R2.2 USB1.1

Not connected (* = marked no-connect by the designer): CR1 2(DOUT)*; U1 27(PD7_(T0/OC4D/ADC10)) 28(PB4_(PCINT4/ADC11)) 36(PF7_(ADC7/TDI)); XTAL1 1 2 3 4

## Notes on the sheet
- Title
- Size:
- Date:
- File:
- A0
- Number:
- Time:
- Revision:
- Sheet
- of
- (in symbol Skey LM) Skey

## Library data of the parts
1-17 35-50 66-76 = Skey LM: Skey but the LED is mirrored for ease of wiring
18-34 51-65 = Skey: Skaytacium's keyboard's key's symbol
C1 = CMP-2000-05439-1: Chip Capacitor, 100 nF, +/- 10%, 16 V, -55 to 125 degC, 0402 (1005 Metric), RoHS, Tape and Reel; Manufacturer: Samsung Electro-Mechanics; Capacitance: 100000pF; Dielectric: X7R; Rated Voltage: 16V; Case Size/Dimension: 0402; Tolerance (%): ±10%; Manufacturer URL: http://www.samsungsem.com/global/index.jsp; Datasheet URL: https://datasheet.ciiva.com/29198/458718-da-01-en-vs-kondensator-0402-29198423.pdf; Datasheet Version: Nov-10
C2 C3 = CMP-2008-03283-1: Part Number: C0402C470J5GACTU; Manufacturer: Kemet
C4 C5 = CMP-2008-02613-1: Part Number: 04025A220JAT2A; Manufacturer: AVX Interconnect / Elco
C6-C11 = CMP-03020-023811-1: CAP CER 0.1UF 10V X5R 0402; Manufacturer: Kemet; Manufacturer Part Number: C0402C104K8PACTU; Material: Ceramic; Capacitance: 0.10 μF; Temperature Coefficient: 15%; Tolerance: 0.1; Value: 0.10 μF; Package: C0402-BB; Temperature: -55°C to +125°C; ComponentLink2Description: Datasheet; Temperature Characteristic: X5R; Device Class L1: Passive Components; Height: 0.55mm; Lead Free: Yes; ComponentLink2URL: https://content.kemet.com/datasheets/KEM_C1002_X7R_SMD.pdf; Device Class L2: Capacitors; Temperature Range Low: -55°C; Temperature Range High: +125°C; RoHS: TRUE; Octopart: https://octopart.com/c0402c104k8pactu-kemet-140039; Automotive: No; Mouser Description: Capacitor 100 nF 10 VDC 0402; Category: Cap; Voltage Rating: 10 V; Digikey Description: CAP CER 0.1UF 10V X5R 0402; Ipc Land Pattern Name: CAPC10050X50; Device Class L3: Ceramic Capacitors
CR1-CR44 = SK6812 Mini-E: SK6812 Mini-E component because I cannot find it anywhere
R1 R2 = CMP-2002-08382-1: Manufacturer: Vishay Dale; Part Number: CRCW040222R0FKED
R3 = CMP-2002-01183-1: Part Number: ERT-J0ER103J; Manufacturer: Panasonic
RST1 USB1 = MHDR1X2: Header, 2-Pin; LatestRevisionDate: 17-Jul-2002; LatestRevisionNote: Re-released for DXP Platform.; Publisher: Altium Limited
U1 = CMP-0095-00285-2: 8-bit AVR Microcontroller, 2.7-5.5V, 16MHz, 32KB Flash, 1KB EEPROM, 2.5KB SRAM, USB Controller, 44-pin TQFP, Industrial Grade (-40°C to 85°C), Ext Osc; RevisionNote: DatasheetVersion updated. URLs added.; ComponentLink1Description: Manufacturer URL; PackageDescription: 44-Pin Plastic Thin Quad Flat Pack, 10 x 10 x 1.0 mm Body, 0.8 mm Pitch (TQFP); DatasheetVersion: revF, Nov-2010; ComponentLink2URL: http://www.atmel.com/dyn/resources/prod_documents/doc7766.pdf; ComponentLink1URL: http://www.atmel.com/; PackageReference: 44ML; ComponentLink2Description: ATmega16U4/32U4 Datasheet; PackageVersion: rev.G, Jul-2007; ComponentLink3URL: http://www.atmel.com/dyn/resources/prod_documents/7766S.pdf; ComponentLink3Description: ATmega16U4 ATmega32U4 Summary
XTAL1 = 16Mhz: LCSC didn't have the footprint, LCSC part: C13738